# EAGLE design AC to DC (EAGLE 9.6.2)
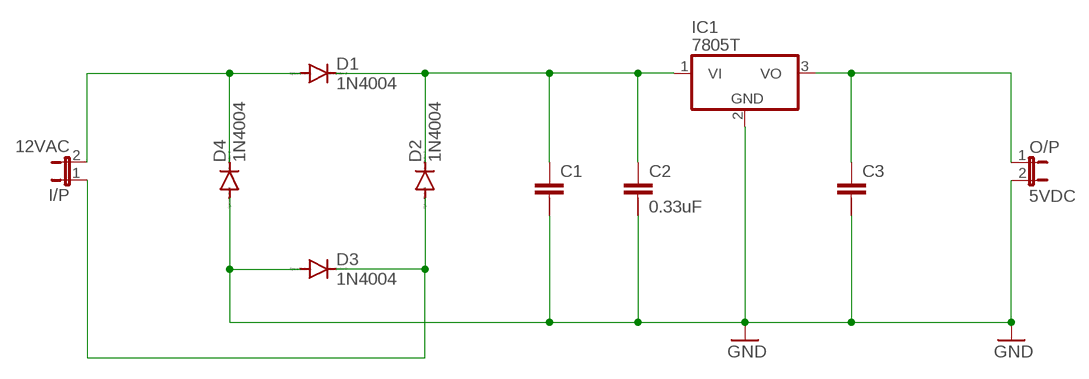
[diagram p0: schematic, sheet 1]

## Parts
C1  C-2.5-5/2  [C2.5/5-2]
C2  0.33uF  C-2.5-5/2  [C2.5/5-2]
C3  C-2.5-5/2  [C2.5/5-2]
D1  1N4004  [DO41-10]
D2  1N4004  [DO41-10]
D3  1N4004  [DO41-10]
D4  1N4004  [DO41-10]
I/P  12VAC  JP1E  [JP1]
IC1  7805T  [TO220H]
O/P  5VDC  JP1E  [JP1]

## Nets
GND: C1.2 C2.2 C3.2 D3.A D4.A IC1.2(GND) O/P.2
N$1: D1.A D4.C I/P.2
N$3: C1.1 C2.1 D1.C D2.C IC1.1(VI)
N$4: D2.A D3.C I/P.1
N$5: C3.1 IC1.3(VO) O/P.1
Unconnected: C1.3 C2.3 C3.3

## Library data of the parts
C1-C3 = capacitor-wima:C-: CAPACITOR for alternative placement naming: default grid - extended grid/package width
D1-D4 = diode:1N4004: DIODE general purpose rectifier, 1 A
I/P O/P = jumper:JP1E: JUMPER
IC1 = linear:78*: Positive VOLTAGE REGULATOR Source: http://cache.national.com/ds/LM/LM78L05.pdf http://www.fairchildsemi.com/ds/LM/LM7805.pdf

## Board
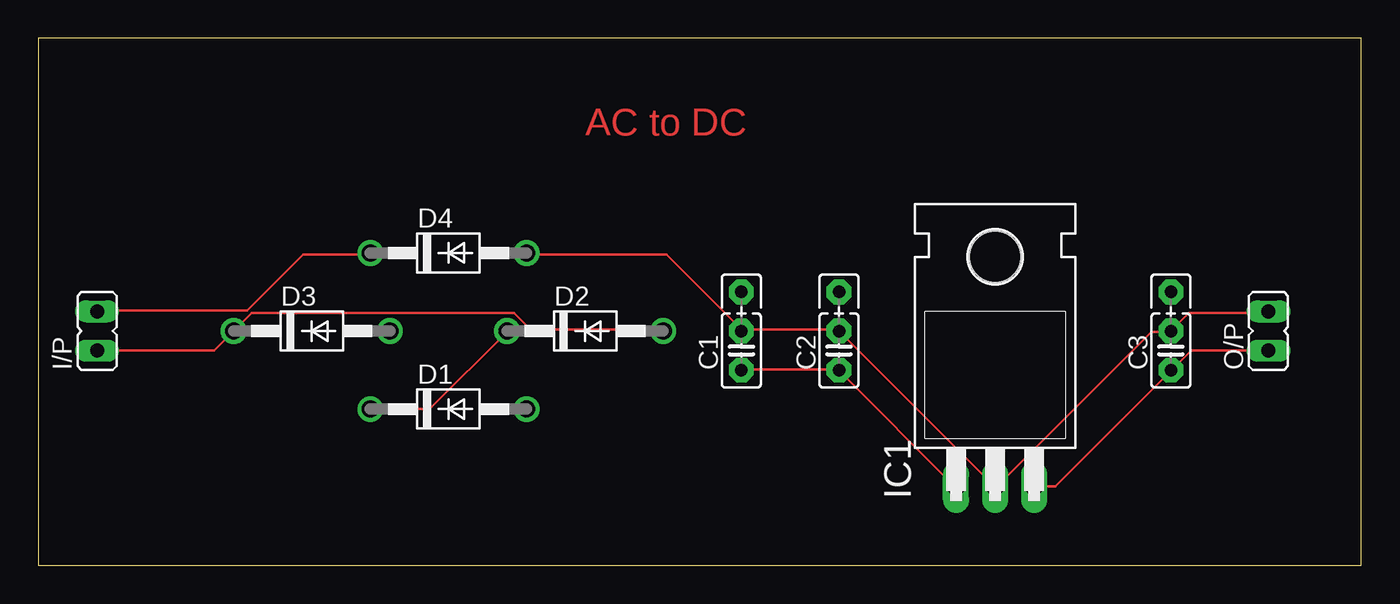
[diagram p1: board, top side]
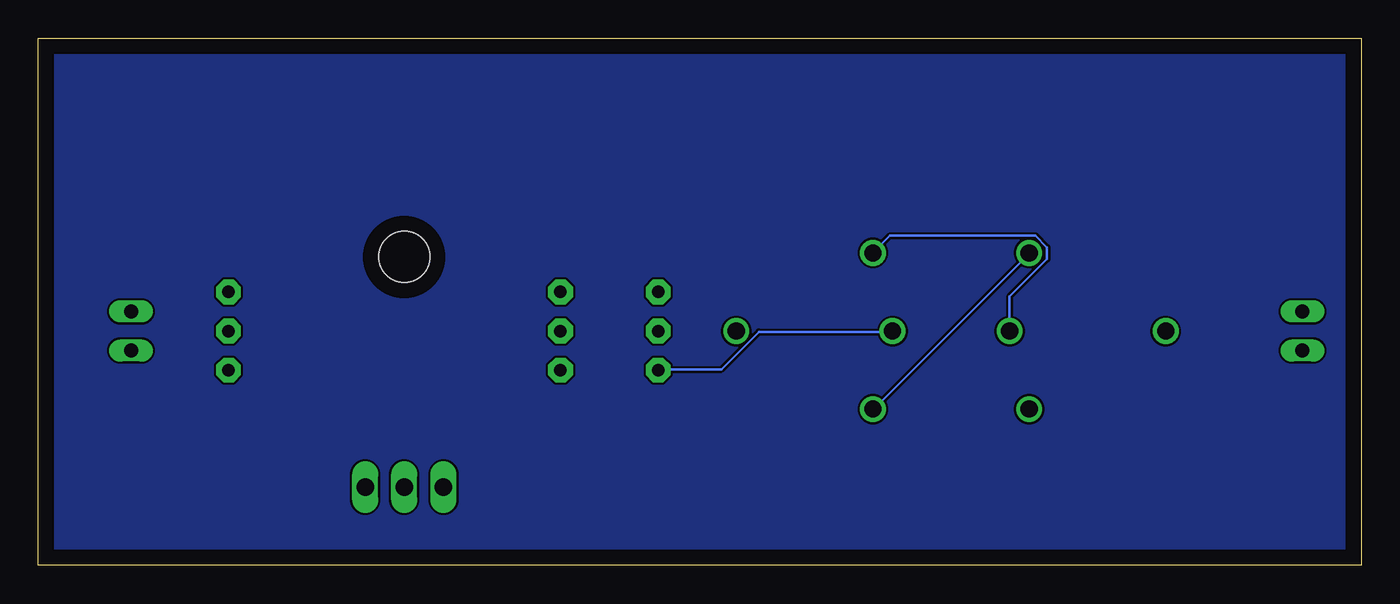
[diagram p2: board, bottom side, seen from below]

Size 86.03 x 34.28 mm. Coordinates in mm from the lower left corner, seen from the top.
Outline: 0,0 86.03,0 86.03,34.28 0,34.28 0,0
Copper layers (1*16): Top 0.035mm / dielectric 1.5mm / Bottom 0.035mm
Design rules "default": minimum track width 6mil, minimum drill 0.35mm, track to track 6mil, track to pad 6mil, pad to pad 6mil, via to via 6mil, smd to smd 6mil, copper to edge 40mil, drill to drill 6mil, minimum pad ring 10mil, minimum via ring 8mil, stop-mask expansion 4mil, vias tented up to drill 0mil, thermal gap 10mil

### Footprints (pad centres in the part's own frame; a part is rotated, then mirrored left to right if it is on the bottom)
C2.5/5-2 = drill 0.813 pad 1.6 octagon: 1 -1.27,0; 2 1.27,0; 3 3.81,0
DO41-10 = drill 1.118: A 5.08,0; C -5.08,0
JP1 = drill 0.914 long: 1 0,-1.27; 2 0,1.27
TO220H = drill 1.118 long: 1 -2.54,-10.16; 2 0,-10.16; 3 2.54,-10.16 | hole 3.302: 0,4.826

### Placement (x,y rotation side)
C1  45.72,13.97 90 top
C2  52.07,13.97 90 top
C3  73.66,13.97 90 top
D1  26.67,10.16 0 top
D2  35.56,15.24 0 top
D3  17.78,15.24 0 top
D4  26.67,20.32 0 top
I/P  3.81,15.24 0 top
IC1  62.23,15.24 0 top
O/P  80.01,15.24 0 top

### Tracks (layer width: path | path; a pad name or v marks a point on that pad's centre or on a via)
GND
  Top 0.152: O/P.2 80.01,16.41 74.83,16.41 C3.2 73.61,15.19 72.39,15.19 62.33,5.13 IC1.2 C2.2 51.97,15.34 45.72,15.34 | 45.72,15.34 40.84,20.22 31.85,20.22 D4.A | 45.72,15.34 C1.2
  Bottom 0.152: D3.A 22.86,17.48 20.42,19.91 20.42,20.68 21.18,21.44 30.63,21.44 D4.A
N$1
  Top 0.152: I/P.2 3.81,16.56 13.56,16.56 17.22,20.22 21.49,20.22 D4.C
  Bottom 0.152: D1.A 31.7,10.16 21.64,20.22 D4.C
N$3
  Top 0.152: D1.C 25.45,10.16 30.48,15.19 D2.C | C1.1 45.72,12.75 51.97,12.75 C2.1 52.12,12.6 59.59,5.13 IC1.1
  Bottom 0.152: D2.C 30.48,15.19 39.17,15.19 41.6,12.75 45.72,12.75 C1.1
N$4
  Top 0.152: I/P.1 11.43,13.97 D3.C 13.87,16.41 30.94,16.41 32,15.34 40.54,15.34 D2.A
N$5
  Top 0.152: O/P.1 74.98,13.97 73.76,12.75 C3.1 73.61,12.6 66.14,5.13 64.77,5.13 IC1.3
PCB
  pour Bottom: 0,34.29 86.36,34.29 86.36,0 0,0

### Text on the board
Top: AC to DC